# Altium project datapool_8810.PrjPcb (part 2 of 2)

## Sheet 8810.SchDoc
size A1; SheetNumber: 7; SheetTotal: 7
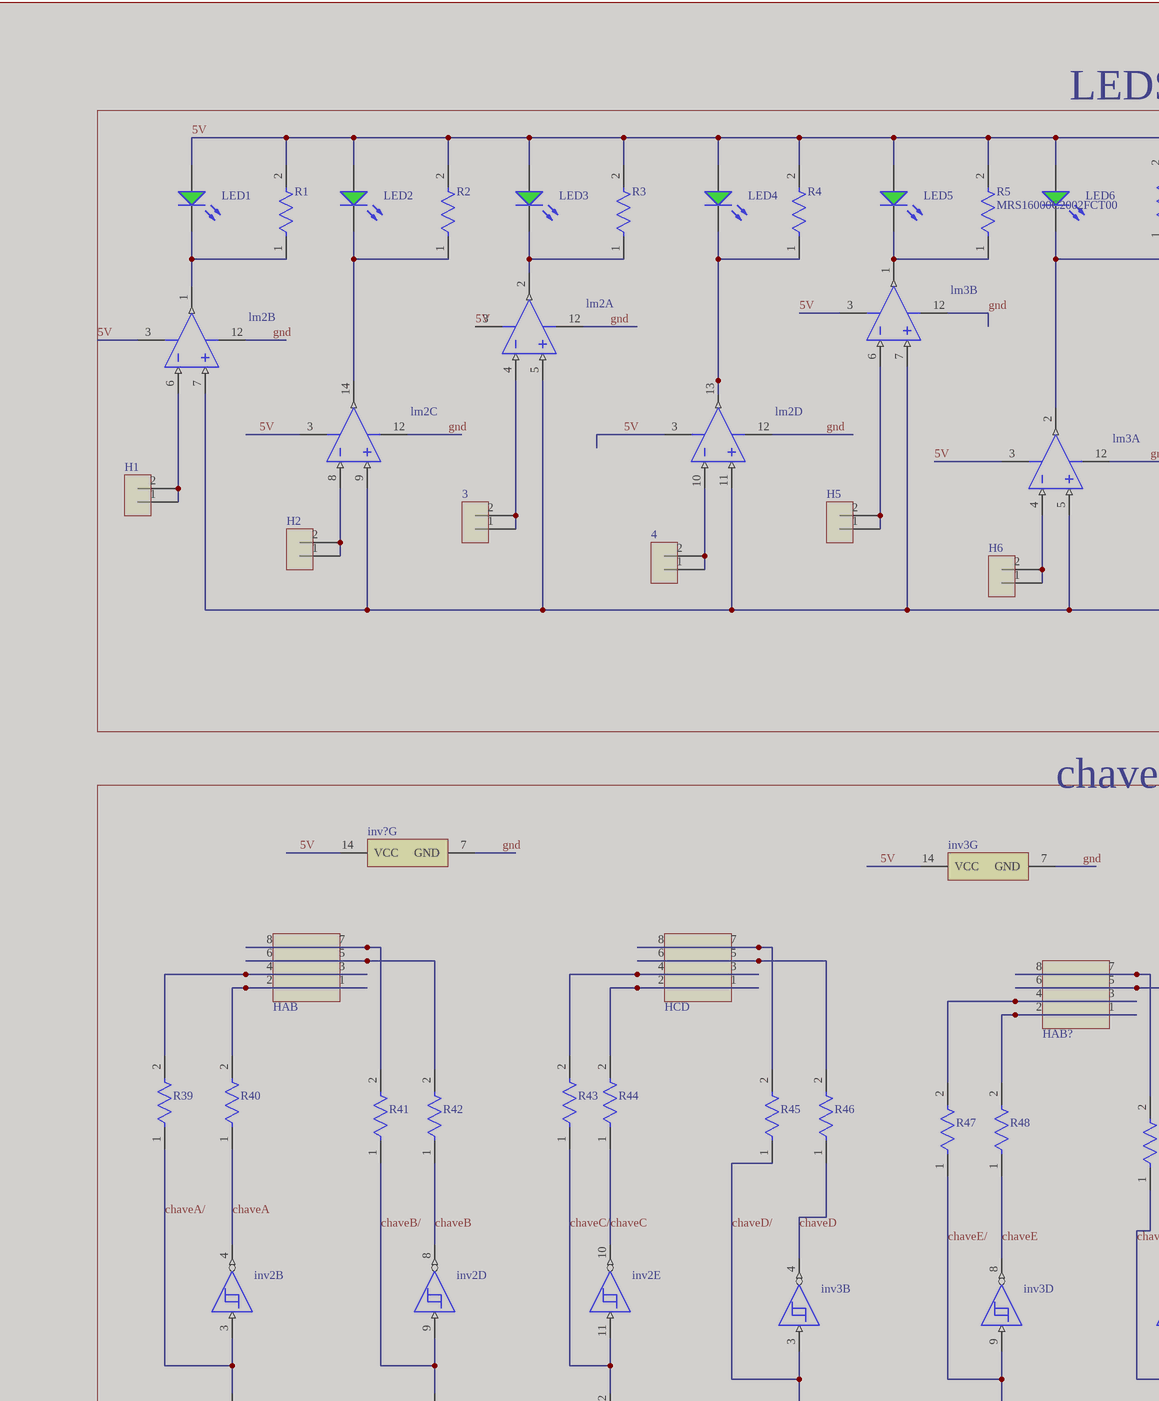
[diagram p6: 8810.SchDoc, top left]
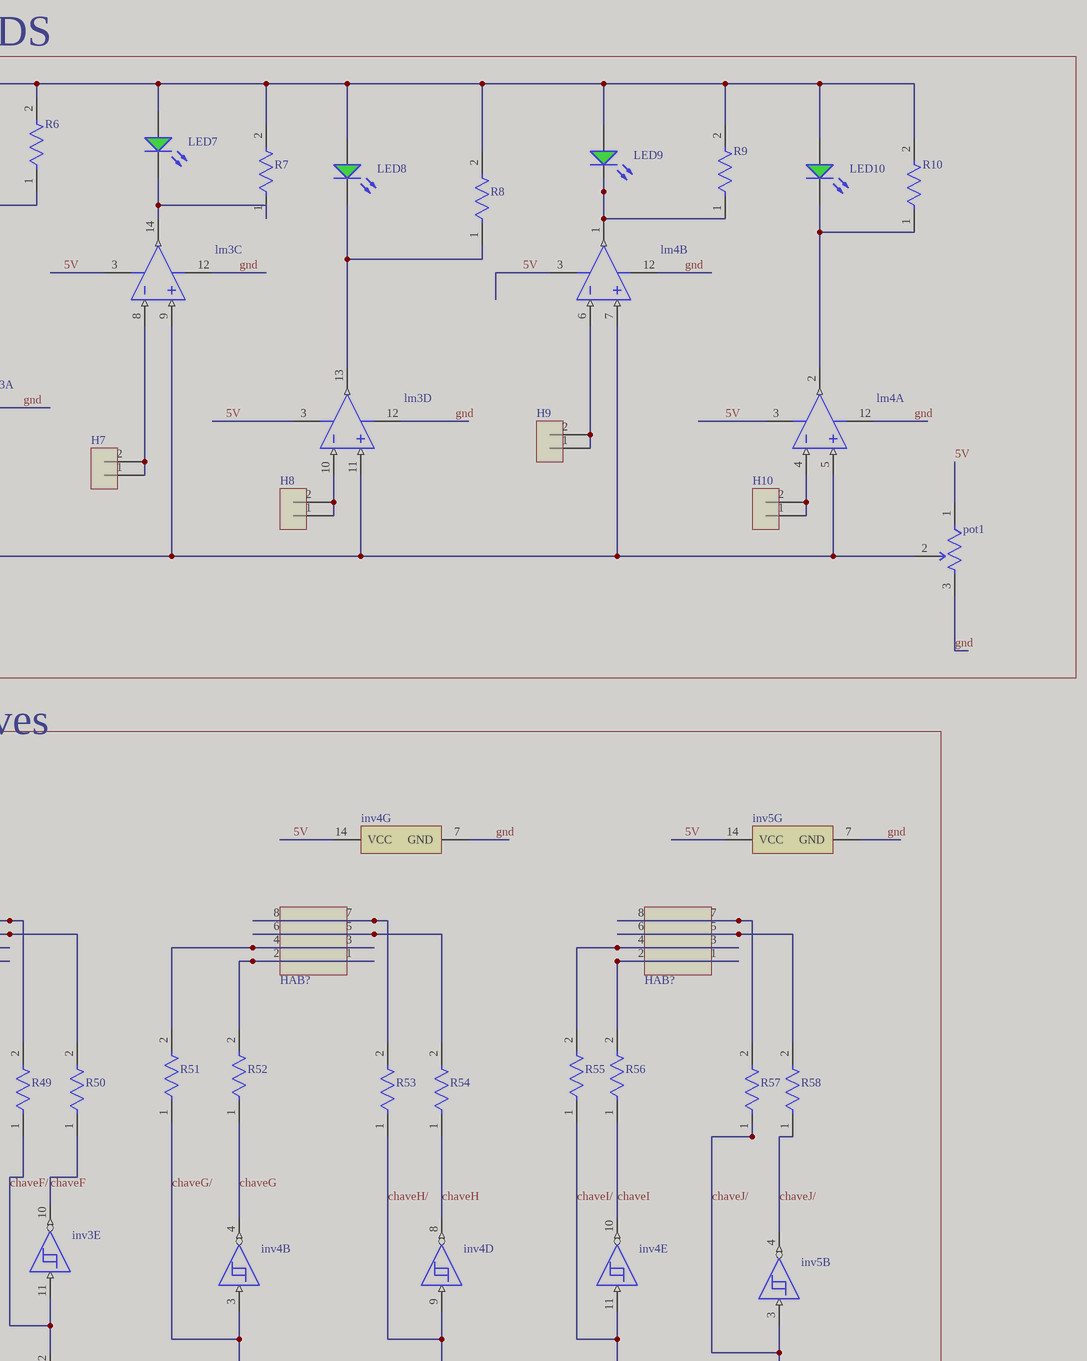
[diagram p7: 8810.SchDoc, top middle]
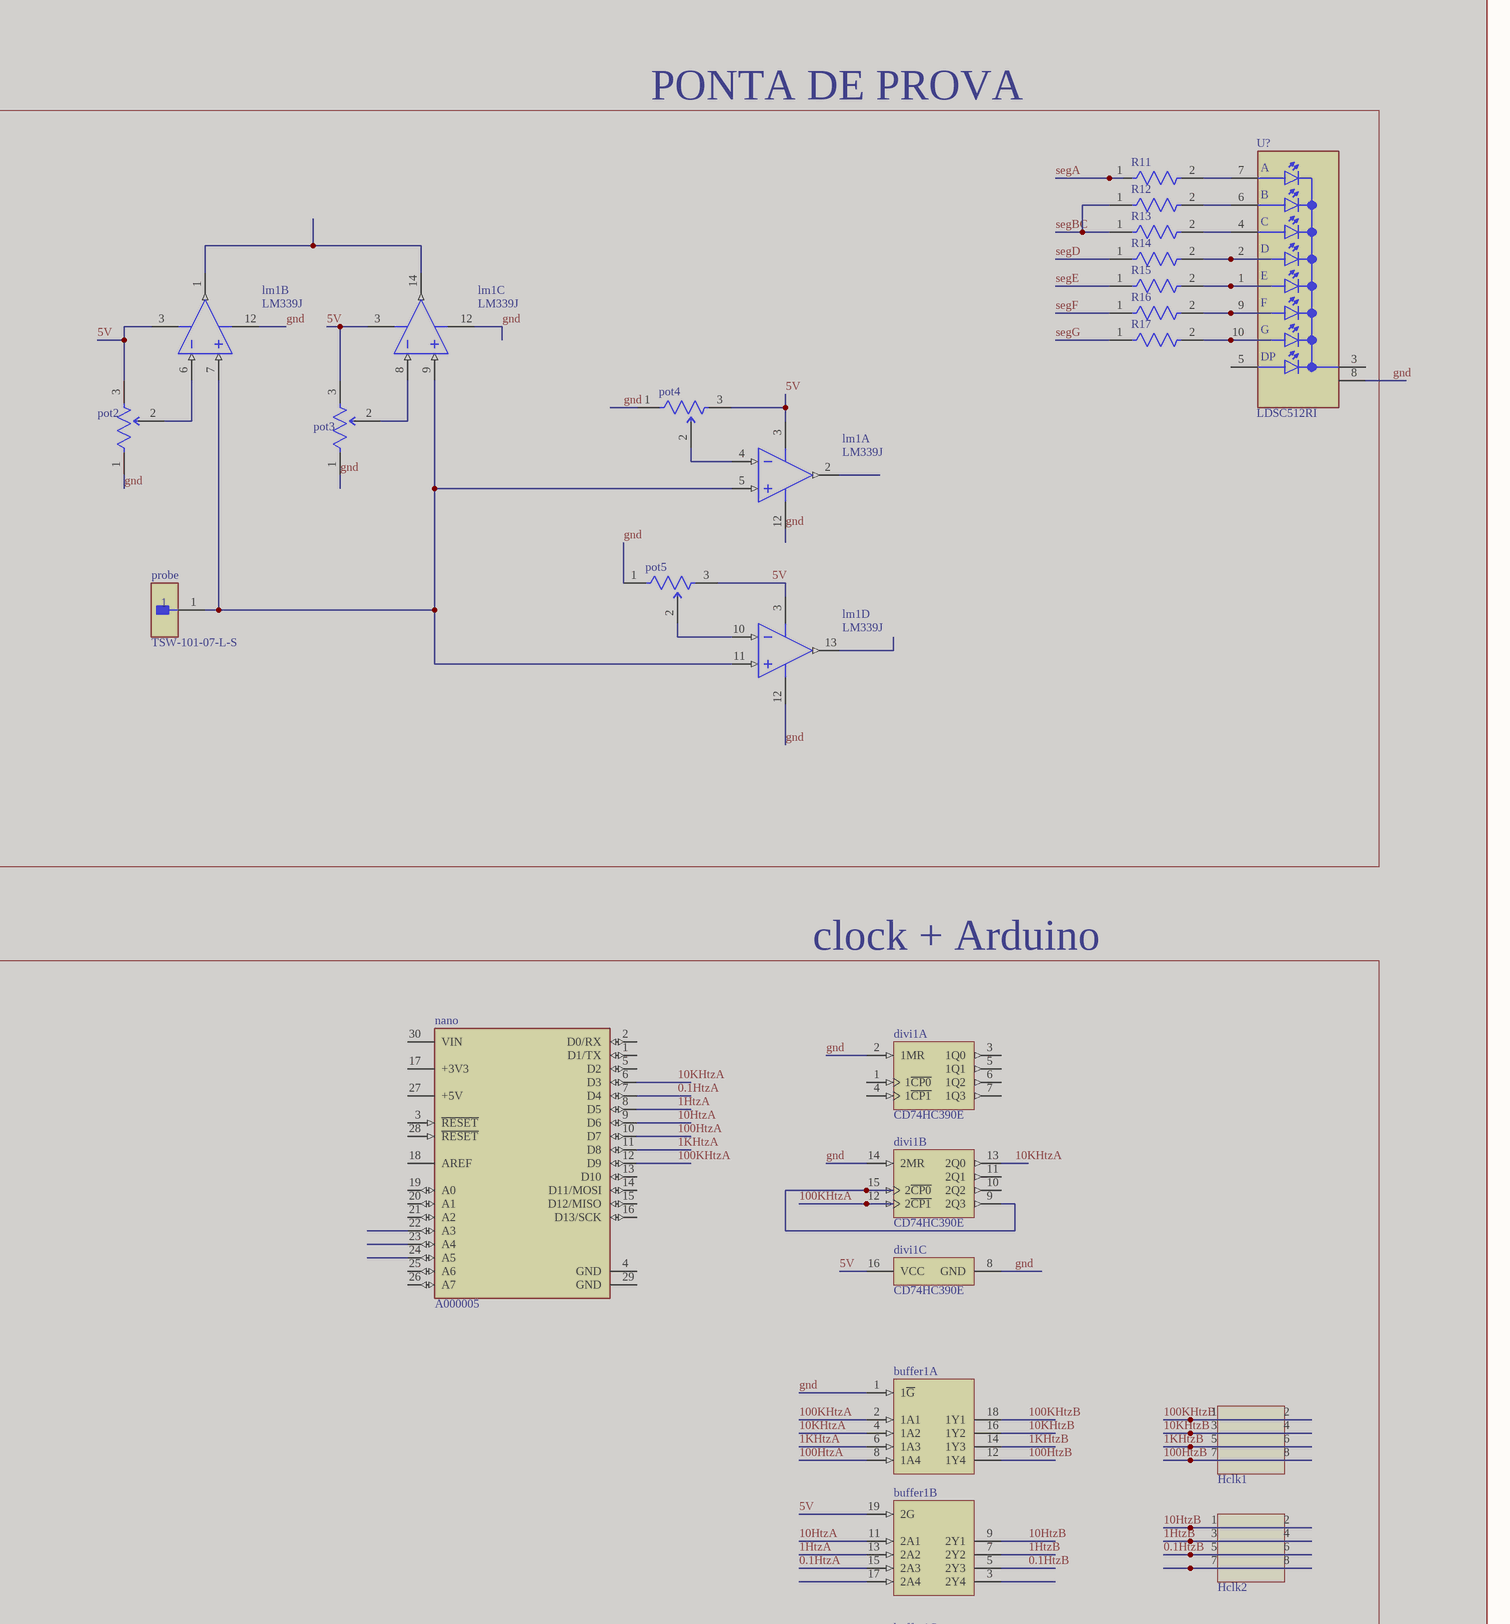
[diagram p8: 8810.SchDoc, top right]
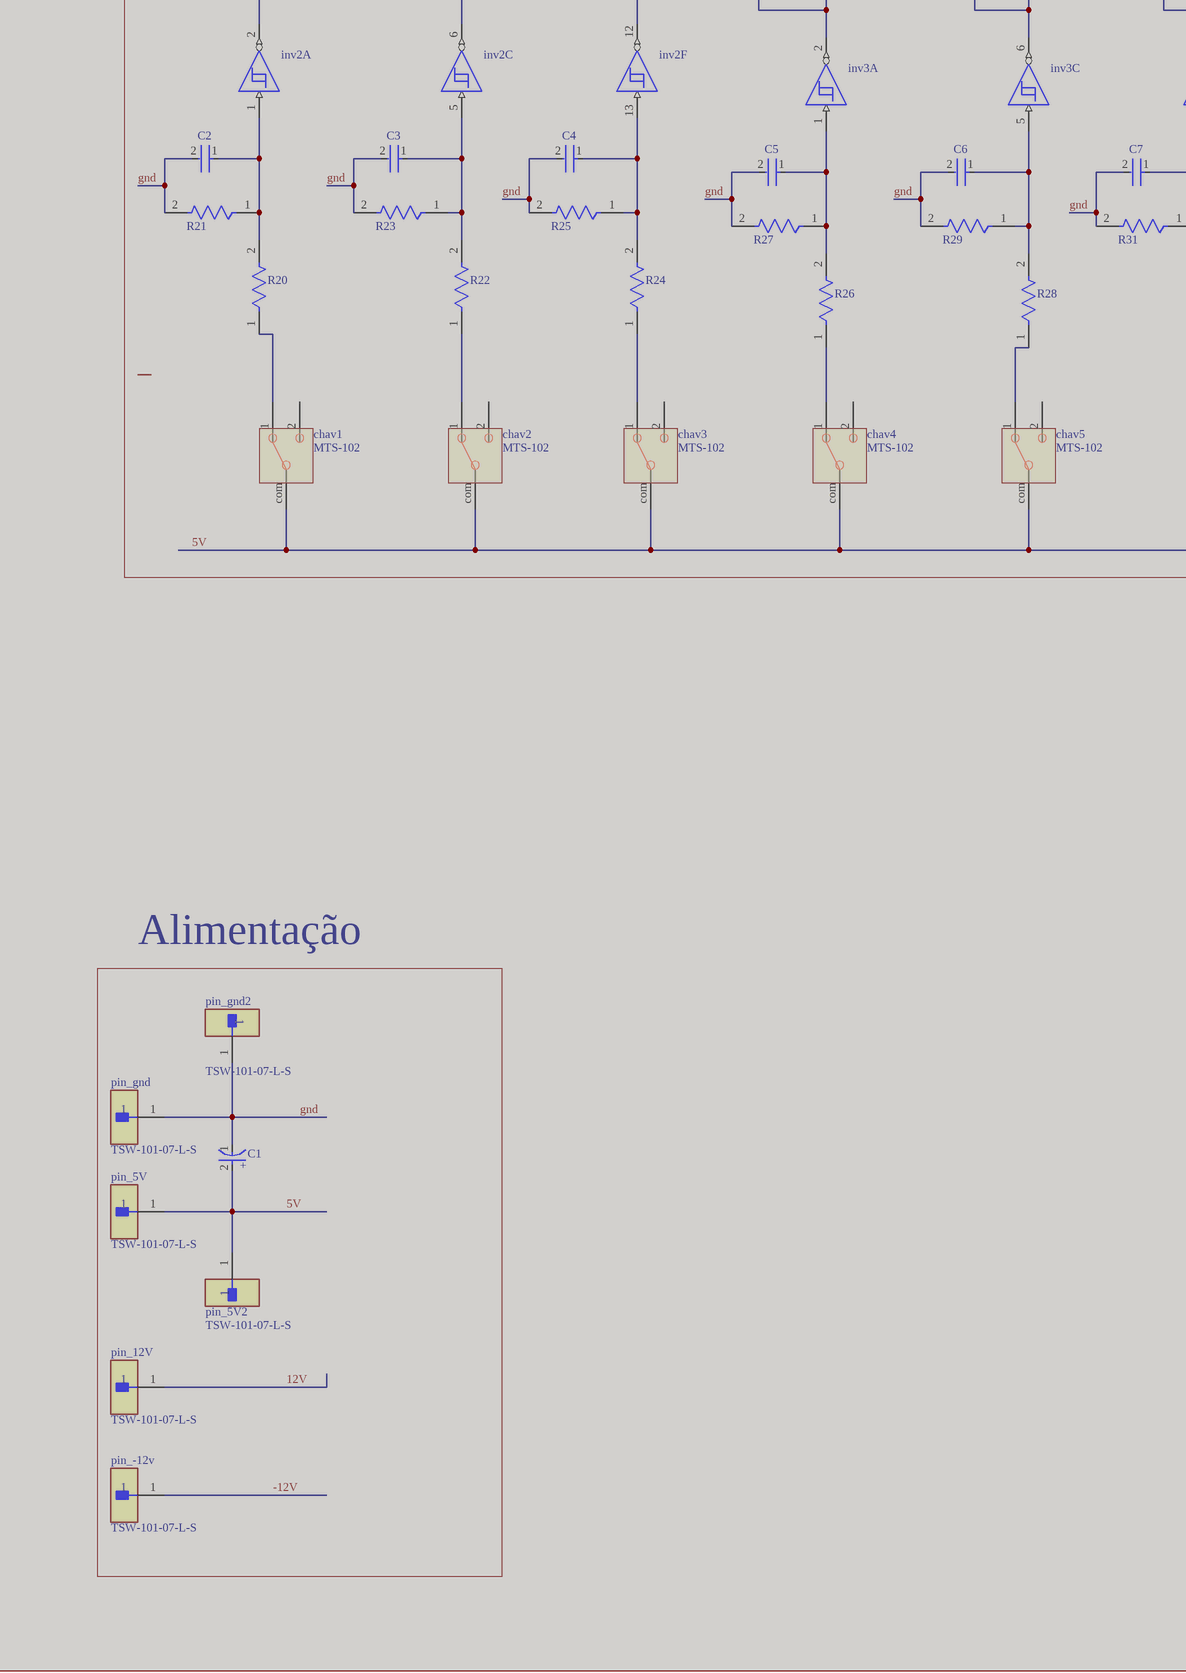
[diagram p9: 8810.SchDoc, bottom left]
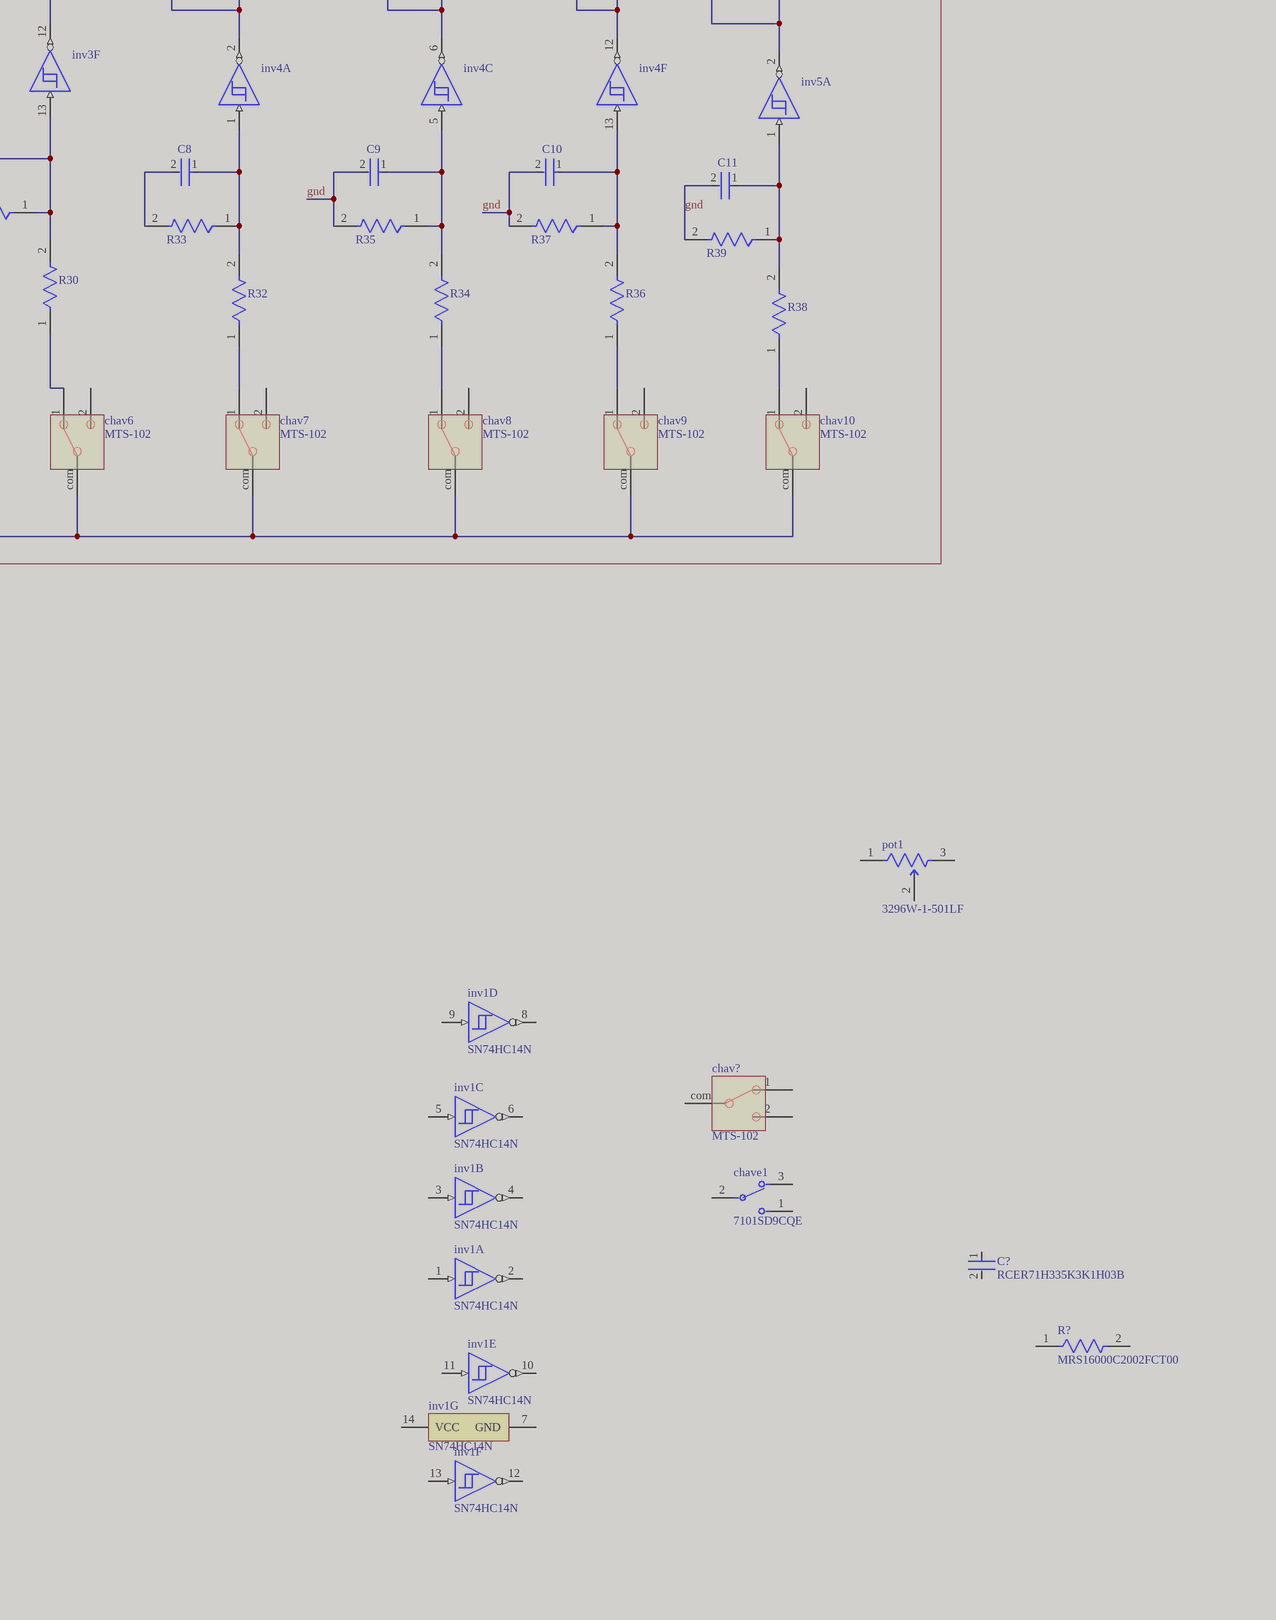
[diagram p10: 8810.SchDoc, bottom middle]
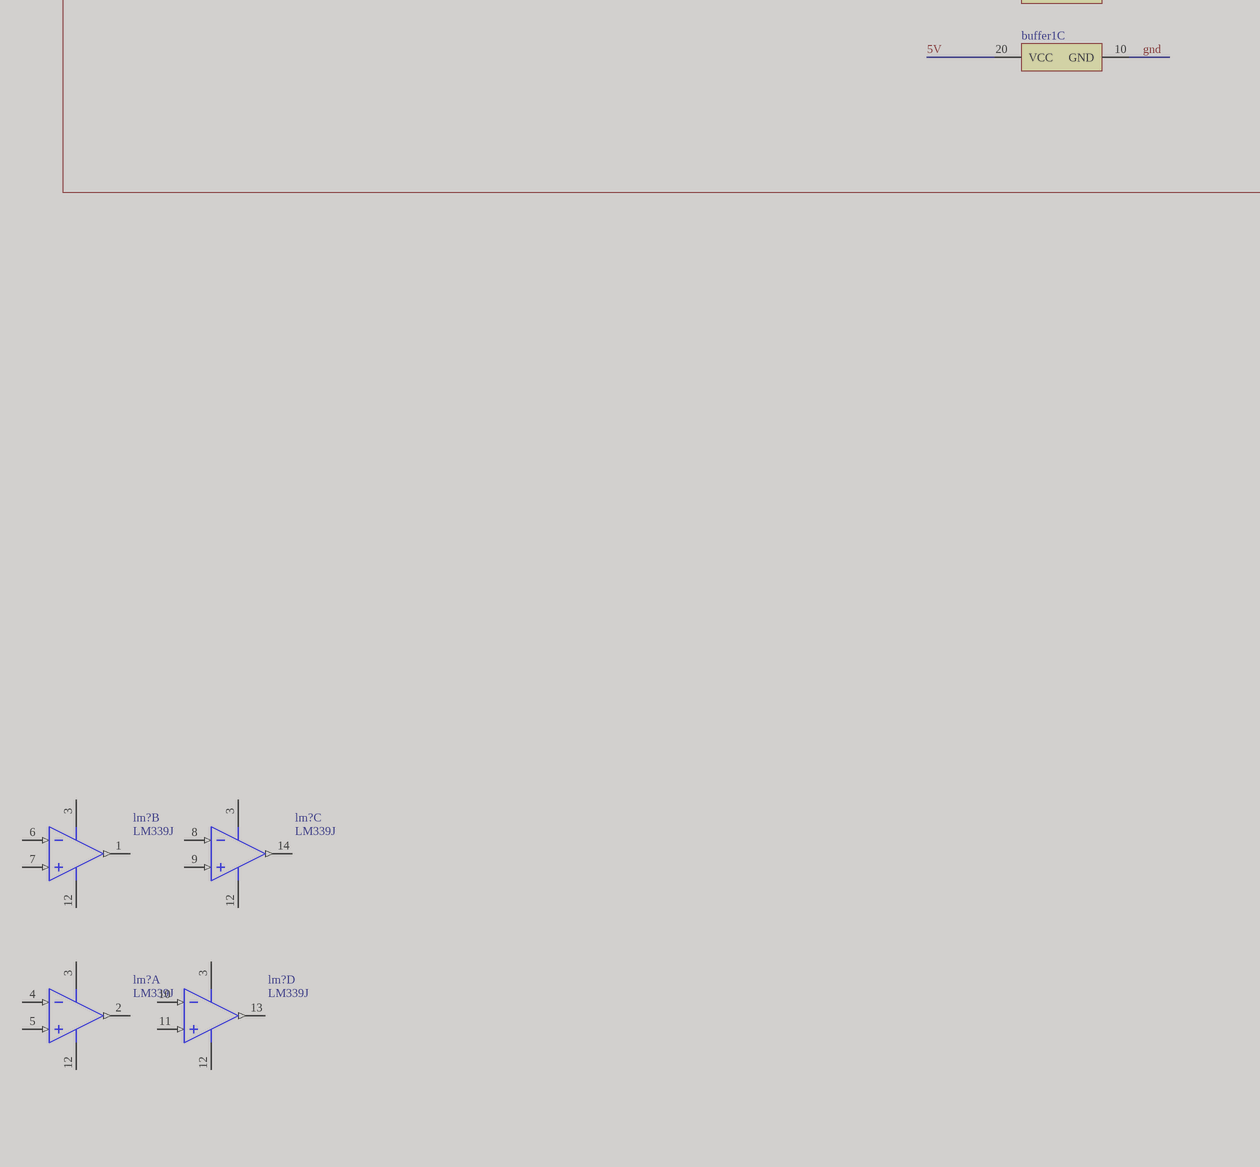
[diagram p11: 8810.SchDoc, bottom right]

### Parts
(Parts that share a designator on the sheet are numbered #1, #2 ... from top to bottom, then left to right.)
3  header 2x1  [PCBComponent_1]  (value not drawn)  (masked out: inside a compile mask, not in the netlist)
4  header 2x1  [PCBComponent_1]  (value not drawn)  (masked out: inside a compile mask, not in the netlist)
buffer1#2  SN74LS241N  [N0020A]  (value not drawn)  (parts A,B,C of 3)  (masked out: inside a compile mask, not in the netlist)
C1#2  EEU-FM1H101BJ  [FP-FM8-MFG]  (value not drawn)  (masked out: inside a compile mask, not in the netlist)
C2#2  RCER71H335K3K1H03B  [FP-RCE3M1-MFG]  (value not drawn)  (masked out: inside a compile mask, not in the netlist)
C3#2  RCER71H335K3K1H03B  [FP-RCE3M1-MFG]  (value not drawn)  (masked out: inside a compile mask, not in the netlist)
C4#2  RCER71H335K3K1H03B  [FP-RCE3M1-MFG]  (value not drawn)  (masked out: inside a compile mask, not in the netlist)
C5#2  RCER71H335K3K1H03B  [FP-RCE3M1-MFG]  (value not drawn)  (masked out: inside a compile mask, not in the netlist)
C6#2  RCER71H335K3K1H03B  [FP-RCE3M1-MFG]  (value not drawn)  (masked out: inside a compile mask, not in the netlist)
C7#2  RCER71H335K3K1H03B  [FP-RCE3M1-MFG]  (value not drawn)  (masked out: inside a compile mask, not in the netlist)
C8#2  RCER71H335K3K1H03B  [FP-RCE3M1-MFG]  (value not drawn)  (masked out: inside a compile mask, not in the netlist)
C9#2  RCER71H335K3K1H03B  [FP-RCE3M1-MFG]  (value not drawn)  (masked out: inside a compile mask, not in the netlist)
C10#2  RCER71H335K3K1H03B  [FP-RCE3M1-MFG]  (value not drawn)  (masked out: inside a compile mask, not in the netlist)
C11#2  RCER71H335K3K1H03B  [FP-RCE3M1-MFG]  (value not drawn)  (masked out: inside a compile mask, not in the netlist)
C?  RCER71H335K3K1H03B  [FP-RCE3M1-MFG]  (masked out: inside a compile mask, not in the netlist)
chav1  chave MTS-102  [MTS-102]  (value not drawn)  (masked out: inside a compile mask, not in the netlist)
chav2  chave MTS-102  [MTS-102]  (value not drawn)  (masked out: inside a compile mask, not in the netlist)
chav3  chave MTS-102  [MTS-102]  (value not drawn)  (masked out: inside a compile mask, not in the netlist)
chav4  chave MTS-102  [MTS-102]  (value not drawn)  (masked out: inside a compile mask, not in the netlist)
chav5  chave MTS-102  [MTS-102]  (value not drawn)  (masked out: inside a compile mask, not in the netlist)
chav6  chave MTS-102  [MTS-102]  (value not drawn)  (masked out: inside a compile mask, not in the netlist)
chav7  chave MTS-102  [MTS-102]  (value not drawn)  (masked out: inside a compile mask, not in the netlist)
chav8  chave MTS-102  [MTS-102]  (value not drawn)  (masked out: inside a compile mask, not in the netlist)
chav9  chave MTS-102  [MTS-102]  (value not drawn)  (masked out: inside a compile mask, not in the netlist)
chav10  chave MTS-102  [MTS-102]  (value not drawn)  (masked out: inside a compile mask, not in the netlist)
chav?  chave MTS-102  [MTS-102]  (value not drawn)  (masked out: inside a compile mask, not in the netlist)
chave1  7101SD9CQE  [FP-7101SD9CQE-MFG]  (masked out: inside a compile mask, not in the netlist)
divi1#2  CD74HC390E  [N0016A]  (parts A,B,C of 3)  (masked out: inside a compile mask, not in the netlist)
H1  header 2x1  [PCBComponent_1]  (value not drawn)  (masked out: inside a compile mask, not in the netlist)
H2  header 2x1  [PCBComponent_1]  (value not drawn)  (masked out: inside a compile mask, not in the netlist)
H5  header 2x1  [PCBComponent_1]  (value not drawn)  (masked out: inside a compile mask, not in the netlist)
H6  header 2x1  [PCBComponent_1]  (value not drawn)  (masked out: inside a compile mask, not in the netlist)
H7  header 2x1  [PCBComponent_1]  (value not drawn)  (masked out: inside a compile mask, not in the netlist)
H8  header 2x1  [PCBComponent_1]  (value not drawn)  (masked out: inside a compile mask, not in the netlist)
H9  header 2x1  [PCBComponent_1]  (value not drawn)  (masked out: inside a compile mask, not in the netlist)
H10  header 2x1  [PCBComponent_1]  (value not drawn)  (masked out: inside a compile mask, not in the netlist)
HAB  header 2x4  [header 2x4]  (value not drawn)  (masked out: inside a compile mask, not in the netlist)
HAB?#1  header 2x4  [header 2x4]  (value not drawn)  (masked out: inside a compile mask, not in the netlist)
HAB?#2  header 2x4  [header 2x4]  (value not drawn)  (masked out: inside a compile mask, not in the netlist)
HAB?#3  header 2x4  [header 2x4]  (value not drawn)  (masked out: inside a compile mask, not in the netlist)
HCD  header 2x4  [header 2x4]  (value not drawn)  (masked out: inside a compile mask, not in the netlist)
Hclk1#2  header 2x4  [header 2x4]  (value not drawn)  (masked out: inside a compile mask, not in the netlist)
Hclk2#2  header 2x4  [header 2x4]  (value not drawn)  (masked out: inside a compile mask, not in the netlist)
inv1#2  SN74HC14N  [N0014A]  (parts A,B,C,D,E,F,G of 7)  (masked out: inside a compile mask, not in the netlist)
inv2#2  SN74HC14N  [N0014A]  (value not drawn)  (parts A,B,C,D,E,F of 7)  (masked out: inside a compile mask, not in the netlist)
inv3#2  SN74HC14N  [N0014A]  (value not drawn)  (parts A,B,C,D,E,F,G of 7)  (masked out: inside a compile mask, not in the netlist)
inv4#1  SN74HC14N  [N0014A]  (value not drawn)  (parts C,D,E,F of 7)  (masked out: inside a compile mask, not in the netlist)
inv4#2  SN74HC14N  [N0014A]  (value not drawn)  (parts A,B,G of 7)  (masked out: inside a compile mask, not in the netlist)
inv5  SN74HC14N  [N0014A]  (value not drawn)  (parts A,B,G of 7)  (masked out: inside a compile mask, not in the netlist)
inv?  SN74HC14N  [N0014A]  (value not drawn)  (part G of 7)  (masked out: inside a compile mask, not in the netlist)
LED1#2  WP7113SGD  [KING-WP7113SGD_V]  (value not drawn)  (masked out: inside a compile mask, not in the netlist)
LED2#2  WP7113SGD  [KING-WP7113SGD_V]  (value not drawn)  (masked out: inside a compile mask, not in the netlist)
LED3#2  WP7113SGD  [KING-WP7113SGD_V]  (value not drawn)  (masked out: inside a compile mask, not in the netlist)
LED4#2  WP7113SGD  [KING-WP7113SGD_V]  (value not drawn)  (masked out: inside a compile mask, not in the netlist)
LED5#2  WP7113SGD  [KING-WP7113SGD_V]  (value not drawn)  (masked out: inside a compile mask, not in the netlist)
LED6#2  WP7113SGD  [KING-WP7113SGD_V]  (value not drawn)  (masked out: inside a compile mask, not in the netlist)
LED7#2  WP7113SGD  [KING-WP7113SGD_V]  (value not drawn)  (masked out: inside a compile mask, not in the netlist)
LED8#2  WP7113SGD  [KING-WP7113SGD_V]  (value not drawn)  (masked out: inside a compile mask, not in the netlist)
LED9#2  WP7113SGD  [KING-WP7113SGD_V]  (value not drawn)  (masked out: inside a compile mask, not in the netlist)
LED10#2  WP7113SGD  [KING-WP7113SGD_V]  (value not drawn)  (masked out: inside a compile mask, not in the netlist)
lm1#3  LM339J  [J0014A]  (parts A,B,C,D of 4)  (masked out: inside a compile mask, not in the netlist)
lm2#2  LM339J  [J0014A]  (value not drawn)  (parts A,B,C,D of 4)  (masked out: inside a compile mask, not in the netlist)
lm3#1  LM339J  [J0014A]  (value not drawn)  (parts C,D of 4)  (masked out: inside a compile mask, not in the netlist)
lm3#2  LM339J  [J0014A]  (value not drawn)  (parts A,B of 4)  (masked out: inside a compile mask, not in the netlist)
lm4  LM339J  [J0014A]  (value not drawn)  (parts A,B of 4)  (masked out: inside a compile mask, not in the netlist)
lm?#1  LM339J  [J0014A]  (part B of 4)  (masked out: inside a compile mask, not in the netlist)
lm?#2  LM339J  [J0014A]  (part C of 4)  (masked out: inside a compile mask, not in the netlist)
lm?#3  LM339J  [J0014A]  (part A of 4)  (masked out: inside a compile mask, not in the netlist)
lm?#4  LM339J  [J0014A]  (part D of 4)  (masked out: inside a compile mask, not in the netlist)
nano  A000005  [FP-A000005-MFG]  (masked out: inside a compile mask, not in the netlist)
pin_5V2#2  TSW-101-07-L-S  [FP-TSW-101-07-L-S-MFG]  (masked out: inside a compile mask, not in the netlist)
pin_5V#2  TSW-101-07-L-S  [FP-TSW-101-07-L-S-MFG]  (masked out: inside a compile mask, not in the netlist)
pin_12V#2  TSW-101-07-L-S  [FP-TSW-101-07-L-S-MFG]  (masked out: inside a compile mask, not in the netlist)
pin_-12v#2  TSW-101-07-L-S  [FP-TSW-101-07-L-S-MFG]  (masked out: inside a compile mask, not in the netlist)
pin_gnd2#2  TSW-101-07-L-S  [FP-TSW-101-07-L-S-MFG]  (masked out: inside a compile mask, not in the netlist)
pin_gnd#2  TSW-101-07-L-S  [FP-TSW-101-07-L-S-MFG]  (masked out: inside a compile mask, not in the netlist)
pot1#3  3296W-1-501LF  [FP-3296W-MFG]  (value not drawn)  (masked out: inside a compile mask, not in the netlist)
pot1#4  3296W-1-501LF  [FP-3296W-MFG]  (masked out: inside a compile mask, not in the netlist)
pot2#2  3296W-1-501LF  [FP-3296W-MFG]  (value not drawn)  (masked out: inside a compile mask, not in the netlist)
pot3#2  3296W-1-501LF  [FP-3296W-MFG]  (value not drawn)  (masked out: inside a compile mask, not in the netlist)
pot4#2  3296W-1-501LF  [FP-3296W-MFG]  (value not drawn)  (masked out: inside a compile mask, not in the netlist)
pot5#2  3296W-1-501LF  [FP-3296W-MFG]  (value not drawn)  (masked out: inside a compile mask, not in the netlist)
probe  TSW-101-07-L-S  [FP-TSW-101-07-L-S-MFG]  (masked out: inside a compile mask, not in the netlist)
R1#2  MRS16000C2002FCT00  [FP-MRS1600-MFG]  (value not drawn)  (masked out: inside a compile mask, not in the netlist)
R2#2  MRS16000C2002FCT00  [FP-MRS1600-MFG]  (value not drawn)  (masked out: inside a compile mask, not in the netlist)
R3#2  MRS16000C2002FCT00  [FP-MRS1600-MFG]  (value not drawn)  (masked out: inside a compile mask, not in the netlist)
R4#2  MRS16000C2002FCT00  [FP-MRS1600-MFG]  (value not drawn)  (masked out: inside a compile mask, not in the netlist)
R5#2  MRS16000C2002FCT00  [FP-MRS1600-MFG]  (masked out: inside a compile mask, not in the netlist)
R6#2  MRS16000C2002FCT00  [FP-MRS1600-MFG]  (value not drawn)  (masked out: inside a compile mask, not in the netlist)
R7#2  MRS16000C2002FCT00  [FP-MRS1600-MFG]  (value not drawn)  (masked out: inside a compile mask, not in the netlist)
R8#2  MRS16000C2002FCT00  [FP-MRS1600-MFG]  (value not drawn)  (masked out: inside a compile mask, not in the netlist)
R9#2  MRS16000C2002FCT00  [FP-MRS1600-MFG]  (value not drawn)  (masked out: inside a compile mask, not in the netlist)
R10#2  MRS16000C2002FCT00  [FP-MRS1600-MFG]  (value not drawn)  (masked out: inside a compile mask, not in the netlist)
R11#2  MRS16000C2002FCT00  [FP-MRS1600-MFG]  (value not drawn)  (masked out: inside a compile mask, not in the netlist)
R12#2  MRS16000C2002FCT00  [FP-MRS1600-MFG]  (value not drawn)  (masked out: inside a compile mask, not in the netlist)
R13#2  MRS16000C2002FCT00  [FP-MRS1600-MFG]  (value not drawn)  (masked out: inside a compile mask, not in the netlist)
R14#2  MRS16000C2002FCT00  [FP-MRS1600-MFG]  (value not drawn)  (masked out: inside a compile mask, not in the netlist)
R15#2  MRS16000C2002FCT00  [FP-MRS1600-MFG]  (value not drawn)  (masked out: inside a compile mask, not in the netlist)
R16#2  MRS16000C2002FCT00  [FP-MRS1600-MFG]  (value not drawn)  (masked out: inside a compile mask, not in the netlist)
R17#2  MRS16000C2002FCT00  [FP-MRS1600-MFG]  (value not drawn)  (masked out: inside a compile mask, not in the netlist)
R20#2  MRS16000C2002FCT00  [FP-MRS1600-MFG]  (value not drawn)  (masked out: inside a compile mask, not in the netlist)
R21#2  MRS16000C2002FCT00  [FP-MRS1600-MFG]  (value not drawn)  (masked out: inside a compile mask, not in the netlist)
R22#2  MRS16000C2002FCT00  [FP-MRS1600-MFG]  (value not drawn)  (masked out: inside a compile mask, not in the netlist)
R23#2  MRS16000C2002FCT00  [FP-MRS1600-MFG]  (value not drawn)  (masked out: inside a compile mask, not in the netlist)
R24#2  MRS16000C2002FCT00  [FP-MRS1600-MFG]  (value not drawn)  (masked out: inside a compile mask, not in the netlist)
R25#2  MRS16000C2002FCT00  [FP-MRS1600-MFG]  (value not drawn)  (masked out: inside a compile mask, not in the netlist)
R26#2  MRS16000C2002FCT00  [FP-MRS1600-MFG]  (value not drawn)  (masked out: inside a compile mask, not in the netlist)
R27#2  MRS16000C2002FCT00  [FP-MRS1600-MFG]  (value not drawn)  (masked out: inside a compile mask, not in the netlist)
R28#2  MRS16000C2002FCT00  [FP-MRS1600-MFG]  (value not drawn)  (masked out: inside a compile mask, not in the netlist)
R29#2  MRS16000C2002FCT00  [FP-MRS1600-MFG]  (value not drawn)  (masked out: inside a compile mask, not in the netlist)
R30#2  MRS16000C2002FCT00  [FP-MRS1600-MFG]  (value not drawn)  (masked out: inside a compile mask, not in the netlist)
R31#2  MRS16000C2002FCT00  [FP-MRS1600-MFG]  (value not drawn)  (masked out: inside a compile mask, not in the netlist)
R32#2  MRS16000C2002FCT00  [FP-MRS1600-MFG]  (value not drawn)  (masked out: inside a compile mask, not in the netlist)
R33#2  MRS16000C2002FCT00  [FP-MRS1600-MFG]  (value not drawn)  (masked out: inside a compile mask, not in the netlist)
R34#2  MRS16000C2002FCT00  [FP-MRS1600-MFG]  (value not drawn)  (masked out: inside a compile mask, not in the netlist)
R35#2  MRS16000C2002FCT00  [FP-MRS1600-MFG]  (value not drawn)  (masked out: inside a compile mask, not in the netlist)
R36#2  MRS16000C2002FCT00  [FP-MRS1600-MFG]  (value not drawn)  (masked out: inside a compile mask, not in the netlist)
R37#2  MRS16000C2002FCT00  [FP-MRS1600-MFG]  (value not drawn)  (masked out: inside a compile mask, not in the netlist)
R38#2  MRS16000C2002FCT00  [FP-MRS1600-MFG]  (value not drawn)  (masked out: inside a compile mask, not in the netlist)
R39#2  MRS16000C2002FCT00  [FP-MRS1600-MFG]  (value not drawn)  (masked out: inside a compile mask, not in the netlist)
R39#3  MRS16000C2002FCT00  [FP-MRS1600-MFG]  (value not drawn)  (masked out: inside a compile mask, not in the netlist)
R40#2  MRS16000C2002FCT00  [FP-MRS1600-MFG]  (value not drawn)  (masked out: inside a compile mask, not in the netlist)
R41#3  MRS16000C2002FCT00  [FP-MRS1600-MFG]  (value not drawn)  (masked out: inside a compile mask, not in the netlist)
R42#3  MRS16000C2002FCT00  [FP-MRS1600-MFG]  (value not drawn)  (masked out: inside a compile mask, not in the netlist)
R43#3  MRS16000C2002FCT00  [FP-MRS1600-MFG]  (value not drawn)  (masked out: inside a compile mask, not in the netlist)
R44#3  MRS16000C2002FCT00  [FP-MRS1600-MFG]  (value not drawn)  (masked out: inside a compile mask, not in the netlist)
R45#3  MRS16000C2002FCT00  [FP-MRS1600-MFG]  (value not drawn)  (masked out: inside a compile mask, not in the netlist)
R46#3  MRS16000C2002FCT00  [FP-MRS1600-MFG]  (value not drawn)  (masked out: inside a compile mask, not in the netlist)
R47#3  MRS16000C2002FCT00  [FP-MRS1600-MFG]  (value not drawn)  (masked out: inside a compile mask, not in the netlist)
R48#2  MRS16000C2002FCT00  [FP-MRS1600-MFG]  (value not drawn)  (masked out: inside a compile mask, not in the netlist)
R49#2  MRS16000C2002FCT00  [FP-MRS1600-MFG]  (value not drawn)  (masked out: inside a compile mask, not in the netlist)
R50#2  MRS16000C2002FCT00  [FP-MRS1600-MFG]  (value not drawn)  (masked out: inside a compile mask, not in the netlist)
R51#2  MRS16000C2002FCT00  [FP-MRS1600-MFG]  (value not drawn)  (masked out: inside a compile mask, not in the netlist)
R52#2  MRS16000C2002FCT00  [FP-MRS1600-MFG]  (value not drawn)  (masked out: inside a compile mask, not in the netlist)
R53#2  MRS16000C2002FCT00  [FP-MRS1600-MFG]  (value not drawn)  (masked out: inside a compile mask, not in the netlist)
R54#2  MRS16000C2002FCT00  [FP-MRS1600-MFG]  (value not drawn)  (masked out: inside a compile mask, not in the netlist)
R55#2  MRS16000C2002FCT00  [FP-MRS1600-MFG]  (value not drawn)  (masked out: inside a compile mask, not in the netlist)
R56#2  MRS16000C2002FCT00  [FP-MRS1600-MFG]  (value not drawn)  (masked out: inside a compile mask, not in the netlist)
R57#2  MRS16000C2002FCT00  [FP-MRS1600-MFG]  (value not drawn)  (masked out: inside a compile mask, not in the netlist)
R58#2  MRS16000C2002FCT00  [FP-MRS1600-MFG]  (value not drawn)  (masked out: inside a compile mask, not in the netlist)
R?  MRS16000C2002FCT00  [FP-MRS1600-MFG]  (masked out: inside a compile mask, not in the netlist)
U?  LDSC512RI  [LED_LDSC512RI]  (masked out: inside a compile mask, not in the netlist)

### Blocks framed on the sheet
LEDS: 3 4 H1 H2 H5-H10 LED1#2 LED2#2 LED3#2 LED4#2 LED5#2 LED6#2 LED7#2 LED8#2 LED9#2 LED10#2 lm2#2 lm3#1 lm3#2 lm4 pot1#3 R1#2 R2#2 R3#2 R4#2 R5#2 R6#2 R7#2 R8#2 R9#2 R10#2
PONTA DE PROVA: lm1#3 pot2#2 pot3#2 pot4#2 pot5#2 probe R11#2 R12#2 R13#2 R14#2 R15#2 R16#2 R17#2 U?
chaves: C2#2 C3#2 C4#2 C5#2 C6#2 C7#2 C8#2 C9#2 C10#2 C11#2 chav1-chav10 HAB HAB?#1-HAB?#3 HCD inv2#2 inv3#2 inv4#1 inv4#2 inv5 inv? R20#2 R21#2 R22#2 R23#2 R24#2 R25#2 R26#2 R27#2 R28#2 R29#2 R30#2 R31#2 R32#2 R33#2 R34#2 R35#2 R36#2 R37#2 R38#2 R39#2 R39#3 R40#2 R41#3 R42#3 R43#3 R44#3 R45#3 R46#3 R47#3 R48#2 R49#2 R50#2 R51#2 R52#2 R53#2 R54#2 R55#2 R56#2 R57#2 R58#2
clock + Arduino: buffer1#2 divi1#2 Hclk1#2 Hclk2#2 nano
Alimentação: C1#2 pin_5V2#2 pin_5V#2 pin_12V#2 pin_-12v#2 pin_gnd2#2 pin_gnd#2

### Notes on the sheet
- (in symbol CMP-05427-000021-1) +

### Library data of the parts
3 4 H1 H2 H5-H10 = Heade 1x2: header male 2 pin; pin to pad: 1>C1 2>C2; Parameter 1: H2x1; Parameter 2: *
buffer1#2 = CMP-0440-00144-3: Octal Buffers And Line Drivers With 3-State Outputs, N0020A, TUBE; Manufacturer: Texas Instruments; Voltage(Nom)(V): 5; Input Type: TTL; F @ Nom Voltage(Max)(Mhz): 35; tpd @ Nom Voltage(Max)(ns): 18; Bits(#): 8; VCC(Min)(V): 4.75; Rating: Catalog; VCC(Max)(V): 5.25; ICC @ Nom Voltage(Max)(mA): 0.046; Generic Part Number: SN74LS241; Code_JEDEC: MS-001; Operating Temperature Range(C): 0 to 70; PackageVersion: http://www.ti.com/lit/ml/mpdi002c/mpdi002c.pdf; PackageReference: N0020A; Output Type: TTL; DatasheetVersion: SDLS144C
C1#2 = CMP-05427-000021-1: CAP ALUM 100UF 20% 50V RADIAL; Polarity: Polar; Impedance: 61mR; Ripple Current: 870mA; Life (Hours): 3000Hour; Dissipation Factor: 0.1%; Packaging: Ammo Pack; Voltage Rating (DC): 50V; Diameter: 8mm; Radiation Hardening: No; Max Operating Temperature: 105°C; Length: 11.5mm; Tolerance: 20%; Termination: Radial; Features: General Purpose; Case/Package: Radial; Voltage Rating: 50V; Min Operating Temperature: -40°C; Height - Seated (Max): 0.512inch; Mount: Through Hole; Series: FM; Height: 11.5mm; Capacitance: 100uF; ESR (Equivalent Series Resistance): 61mR; Lead Free: Lead Free; Lead Pitch: 0.197inch; Package Quantity: 1000
C2#2 C3#2 C4#2 C5#2 C6#2 C7#2 C8#2 C9#2 C10#2 C11#2 = CMP-06035-028451-1: Cap Ceramic 100nF 50V X7R ±10% Radial 5mm +125°C Automotive Ammo Pack; Capacitance: 3.3uF; Lead Diameter: 0.5mm; Lead/Base Style: Formed Leads; Height: 5mm; Ratings: AEC-Q200; Package Quantity: 500; Length: 0.217inch; Min Operating Temperature: -55°C; Voltage Rating (DC): 50V; Dielectric: X7R; Case/Package: Radial; Height - Seated (Max): 0.197inch; Termination: Radial; Mount: Through Hole; Max Operating Temperature: 125°C; Width: 0.157inch; Voltage Rating: 50V; Packaging: Bulk; Resistor Type: Ceramic; Tolerance: 10%; Lead Pitch: 0.197inch
C? = CMP-06035-028451-1: Cap Ceramic 3.3uF 50V X7R ±10% Radial 5mm +125°C Automotive Ammo Pack; Lead Diameter: 0.5mm; Lead/Base Style: Formed Leads; Height: 5mm; Ratings: AEC-Q200; Capacitance: 3.3uF; Package Quantity: 500; Length: 0.217inch; Min Operating Temperature: -55°C; Voltage Rating (DC): 50V; Dielectric: X7R; Case/Package: Radial; Height - Seated (Max): 0.197inch; Termination: Radial; Mount: Through Hole; Max Operating Temperature: 125°C; Width: 0.157inch; Voltage Rating: 50V; Packaging: Bulk; Resistor Type: Ceramic; Tolerance: 10%; Lead Pitch: 0.197inch
chav1-chav10 chav? = MTS-102: chave caso seja usadsada sendo encaixada; Parameter 1: MTS-102
chave1 = CMP-01151-55410166-1: 7101SD9CQE Toggle Switch, Spdt, On-On, Maintained, 5A, 28Vdc, 3 Pcb Hole Cnt, Solder Terminal, Toggle; Voltage Rating (AC): 120V; Max Voltage Rating (DC): 28V; Illumination Type: Illuminated, Non-Illuminated; Contact Resistance: 10mΩ; Actuator Material: Brass, Chrome; Life (Cycles): 100kcycles; Max Voltage Rating (AC): 250V; Actuator Length: 12.45mm; Max Current Rating: 5A; Contact Current Rating: 5A; Termination: PC Pins; Min Operating Temperature: -30°C; Depth: 6.86mm; Orientation: Straight; Voltage Rating (DC): 28V; Length: 12.7mm; RoHS: Compliant; Housing Material: Stainless Steel; Contact Material: Silver; Contact Plating: Silver; Radiation Hardening: No; Current Rating: 5A; Lead Free: Lead Free; Switch Function: On-On; Mount: Through Hole; Electrical Life: 100kcycles; Throw Configuration: SPDT; Max Operating Temperature: 85°C; NexarPartId: 55410166
divi1#2 = CMP-1623-00557-2: High Speed CMOS Logic Dual Decade Ripple Counters, N0016A, TUBE; Manufacturer: Texas Instruments; Technology Family: HC; ICC @ Nom Voltage(Max)(mA): 0.08; Inputs: 1; F @ Nom Voltage(Max)(Mhz): 28; tpd @ Nom Voltage(Max)(ns): 52; Bits(#): 4; Input Type: LVTTL/CMOS; Schmitt Trigger: No; Output Drive (IOL/IOH)(Max)(mA): 5.2/-5.2; VCC(Max)(V): 6; Rating: Catalog; VCC(Min)(V): 2; Voltage(Nom)(V): 3.3,5; Output Type: CMOS; Code_JEDEC: MS-001; Generic Part Number: CD74HC390; DatasheetVersion: SCHS185C; Function: Counter; Operating Temperature Range(C): -55 to 125; Type: Decade; PackageReference: N0016A
HAB HAB?#1-HAB?#3 HCD Hclk1#2 Hclk2#2 = header 2x4: header male 2x4; pin to pad: 1>C1 2>C2 3>C3 4>C4 5>C5 6>C6 7>C7 8>C8; Parameter 1: header 2x4
inv1#2 inv2#2 inv3#2 inv4#1 inv4#2 inv5 inv? = CMP-1615-00889-3: Hex Schmitt-Trigger Inverters, N0014A, TUBE; Manufacturer: Texas Instruments; Input Type: CMOS; Voltage(Nom)(V): 5; VCC(Min)(V): 2; tpd @ Nom Voltage(Max)(ns): 31; Technology Family: HC; VCC(Max)(V): 6; F @ Nom Voltage(Max)(Mhz): 20; Output Drive (IOL/IOH)(Max)(mA): -4/4; Rating: Catalog; Schmitt Trigger: Yes; ICC @ Nom Voltage(Max)(mA): 0.02; PackageReference: N0014A; Code_JEDEC: MS-001; Operating Temperature Range(C): -40 to 85; Generic Part Number: SN74HC14; Bits(#): 6; DatasheetVersion: SCLS085G; Output Type: CMOS
LED1#2 LED2#2 LED3#2 LED4#2 LED5#2 LED6#2 LED7#2 LED8#2 LED9#2 LED10#2 = CMP-2100-03698-1: LED Green, 62.5 mW, 25 mA, -40 to 85 degC, 2-Pin THD, RoHS, Bulk; Manufacturer: Kingbright; Viewing Angle: 30degrees; Lens Style: Tinted; Test Current: 20mA; Forward Voltage: 2.2V; Wavelength: 568nm; Luminous Intensity: 40mcd; Package Reference: WP7113SGD; Colour: Green; Lead Free: LeadFree; Packaging: Bulk; RoHSCompliant: true; Package Quantity: 1000; Illumination Colour: Green; Case/Package: Radial; Datasheet URL: http://www.kingbrightusa.com/images/catalog/SPEC/WP7113SGD.pdf; Dominant Wavelength: 568nm; Datasheet Version: Rev. 6B, 01/2015; Package Description: 2-Pin Through Hole Device, Dia 5.9 mm, Body Length 8.6 mm; Height: 8.6mm
lm1#3 lm2#2 lm3#1 lm3#2 lm4 lm?#1-lm?#4 = CMP-0060-00012-3: Low Power Low Offset Voltage Quad Comparator, 14-pin CerDIP; Manufacturer: Texas Instruments; PowerWise: N; PackageTopMarking: NSUZXYYTT*LM339J; PackageDescription: Cerdip, .400 x .310in Body, 14 Lead, .300in Centers, .100in Pitch; ComponentLink1Description: Datasheet URL; PinCount: 14; PackageReference: J0014A; ComponentLink1URL: http://www.ti.com/general/docs/lit/getliterature.tsp?genericPartNumber=LM339-N&fileType=pdf; CompType: Comparator; RoHS: N
nano = CMP-189986-000002-1: ARDUINO NANO ATMEGA328 EVAL BRD; Number of Bits: 8; Evaluation Kit: Yes; Operating Supply Voltage: 12V; Interface: I2C; Data Bus Width: 8b; Core Architecture: AVR; Packaging: Bulk; Length: 7inch; Package Quantity: 50; Width: 5inch; REACH SVHC: No SVHC; Weight: 0.358383oz; Series: AVR® ATmega; Height: 0.25inch
pin_5V2#2 pin_5V#2 pin_12V#2 pin_-12v#2 pin_gnd2#2 pin_gnd#2 probe = CMP-02766-001775-1: CONN HEADER VERT 1POS; Gender: Male; Number of Contacts: 1; Max Current Rating: 7.6A; Max Voltage Rating (AC): 550V; RoHS Compliant: Yes; Contact Finish - Mating: GOLD; Length: 2.54mm; Series: TSW; Insulation Material: PBT; Reach SVHC Compliant: Yes; Radiation Hardening: No; Contact Plating: Gold; Termination: Solder; Contact Type: Male Pin; Orientation: Straight; Number of Rows: 1; Depth: 2.54mm; Housing Material: Polyester; Lead Free: Lead Free; Fastening Type: Pull; Flammability Rating: UL94 V-0; Mount: Through Hole; Housing Color: Black; Contact Shape: Square; Min Operating Temperature: -55°C; Connector Type: Header; Contact Mating Length: 0.23inch; Width: 2.54mm; Packaging: Bulk; Contact Material: Bronze; Max Operating Temperature: 125°C; Number of Positions: 1; Color: Black; Insulation Color: Black
pot1#3 pot1#4 pot2#2 pot3#2 pot4#2 pot5#2 = CMP-07234-000046-1: TRIMMER 500 OHM 0.5W PC PIN TOP; Resistance: 500R; Temperature Coefficient: 100ppm/°C; Resistance Tolerance: 10%; Number of Turns: 25; Max Power Dissipation: 500mW; Packaging: Rail/Tube; Color: Blue; Technology: CERMET; Max Operating Temperature: 125°C; RoHS Compliant: Yes; Radiation Hardening: No; Series: 3296; Military Standard: Not; Width: 9.53mm; Weight: 0.03oz; Length: 9.53mm; Package Quantity: 50; Height: 0.395inch; Min Operating Temperature: -55°C; Lead Free: Lead Free; Mount: Through Hole; Depth: 4.83mm; Termination: Pin; Taper: Linear; Contact Plating: Tin; Resistor Type: Cermet; Tolerance: 10%; REACH SVHC: No SVHC; Power Rating: 500mW
R1#2 R2#2 R3#2 R4#2 R5#2 R6#2 R7#2 R8#2 R9#2 R10#2 R? = CMP-02408-000019-1: RES 20K OHM 0.4W 1% AXIAL; Max Power Dissipation: 400mW; Temperature Coefficient: 50ppm/°C; Resistance: 20kR; Technology: THIN FILM; Max Operating Temperature: 155°C; Number of Terminations: 2; RoHS Compliant: Yes; Packaging: Tape and Reel; Radiation Hardening: No; Contact Plating: Tin; Military Standard: Not; Construction: Cylindrical; Diameter: 1.6mm; Tolerance: 1%; Mount: Through Hole; Power Rating: 400mW; Case/Package: Conformal; Termination: Axial; Length: 3.6mm; Min Operating Temperature: -55°C; Resistor Type: Metal Film; Series: MRS16
R11#2 R12#2 R13#2 R14#2 R15#2 R16#2 R17#2 = CMP-02408-000019-1: RES 300 OHM 0.4W 1% AXIAL; Max Power Dissipation: 400mW; Temperature Coefficient: 50ppm/°C; Resistance: 20kR; Technology: THIN FILM; Max Operating Temperature: 155°C; Number of Terminations: 2; RoHS Compliant: Yes; Packaging: Tape and Reel; Radiation Hardening: No; Contact Plating: Tin; Military Standard: Not; Construction: Cylindrical; Diameter: 1.6mm; Tolerance: 1%; Mount: Through Hole; Power Rating: 400mW; Case/Package: Conformal; Termination: Axial; Length: 3.6mm; Min Operating Temperature: -55°C; Resistor Type: Metal Film; Series: MRS16
R20#2 R22#2 R24#2 R26#2 R28#2 R30#2 R32#2 R34#2 R36#2 R38#2 = CMP-02408-000019-1: RES 1K OHM 0.4W 1% AXIAL; Max Power Dissipation: 400mW; Temperature Coefficient: 50ppm/°C; Resistance: 20kR; Technology: THIN FILM; Max Operating Temperature: 155°C; Number of Terminations: 2; RoHS Compliant: Yes; Packaging: Tape and Reel; Radiation Hardening: No; Contact Plating: Tin; Military Standard: Not; Construction: Cylindrical; Diameter: 1.6mm; Tolerance: 1%; Mount: Through Hole; Power Rating: 400mW; Case/Package: Conformal; Termination: Axial; Length: 3.6mm; Min Operating Temperature: -55°C; Resistor Type: Metal Film; Series: MRS16
R21#2 R23#2 R25#2 R27#2 R29#2 R31#2 R33#2 R35#2 R37#2 R39#3 = CMP-02408-000019-1: RES 15K OHM 0.4W 1% AXIAL; Max Power Dissipation: 400mW; Temperature Coefficient: 50ppm/°C; Resistance: 20kR; Technology: THIN FILM; Max Operating Temperature: 155°C; Number of Terminations: 2; RoHS Compliant: Yes; Packaging: Tape and Reel; Radiation Hardening: No; Contact Plating: Tin; Military Standard: Not; Construction: Cylindrical; Diameter: 1.6mm; Tolerance: 1%; Mount: Through Hole; Power Rating: 400mW; Case/Package: Conformal; Termination: Axial; Length: 3.6mm; Min Operating Temperature: -55°C; Resistor Type: Metal Film; Series: MRS16
R39#2 R40#2 R41#3 R42#3 R43#3 R44#3 R45#3 R46#3 R47#3 R48#2 R49#2 R50#2 R51#2 R52#2 R53#2 R54#2 R55#2 R56#2 R57#2 R58#2 = CMP-02408-000019-1: RES 1K OHM 0.4W 1% AXIAL; Max Power Dissipation: 400mW; Temperature Coefficient: 50ppm/°C; Resistance: 1kR; Technology: THIN FILM; Max Operating Temperature: 155°C; Number of Terminations: 2; RoHS Compliant: Yes; Packaging: Tape and Reel; Radiation Hardening: No; Contact Plating: Tin; Military Standard: Not; Construction: Cylindrical; Diameter: 1.6mm; Tolerance: 1%; Mount: Through Hole; Power Rating: 400mW; Case/Package: Conformal; Termination: Axial; Length: 3.6mm; Min Operating Temperature: -55°C; Resistor Type: Metal Film; Series: MRS16
U? = LDSC512RI: .56IN. 7 SEGMENT SINGLE DISPLAY, 565NM GREEN, GRAY FACE, WHITE SEGMENTS, COMMON | Lumex LDS-C512RI; SnapEDA_Link: https://www.snapeda.com/parts/LDS-C512RI/Lumex/view-part/?ref=snap; Package: None; Value: *; MF: Lumex; MP: LDS-C512RI; Check_prices: https://www.snapeda.com/parts/LDS-C512RI/Lumex/view-part/?ref=eda

## Nets that join several sheets
5V: alimentacao (8 pins), leds (lm1#1.3 lm2#1.3 lm3#1.3 pot1#1.1), chaves (14 pins), clock (buffer1#1.19 buffer1#1.20 divi1#1.16 nano1.27), probe (6 pins)
gnd: alimentacao (10 pins), leds (13 pins), chaves (20 pins), clock (5 pins), probe (9 pins)
pin_F: clock (nano1.22), probe (lm1#2.1 lm1#2.14)
pin_Freq: clock (nano1.5), probe (divi1#1.7)
pin_High: clock (nano1.23), probe (divi1#1.4 lm1#2.2)
pin_Low: clock (nano1.24), probe (lm1#2.13)
segA: clock (nano1.13), probe (R41#2.1)
segBC: clock (nano1.14), probe (R42#2.1 R43#2.1)
segD: clock (nano1.15), probe (R44#2.1)
segE: clock (nano1.16), probe (R45#2.1)
segF: clock (nano1.19), probe (R46#2.1)
segG: clock (nano1.20), probe (R47#2.1)